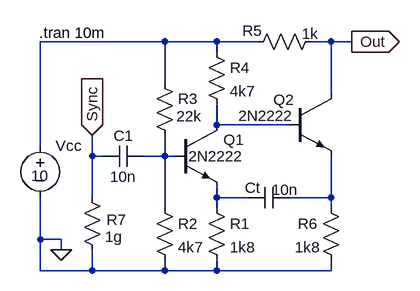
[diagram p0: schematic 2Q&1C_Multivib.asc]
2Q&1C_Multivib.asc, the LTspice schematic file:
Version 4
SHEET 1 880 680
WIRE 80 -16 -112 -16
WIRE 160 -16 80 -16
WIRE 224 -16 160 -16
WIRE 336 -16 304 -16
WIRE 368 -16 336 -16
WIRE 160 0 160 -16
WIRE 80 48 80 -16
WIRE 336 64 336 -16
WIRE 160 112 160 80
WIRE 272 112 160 112
WIRE -112 144 -112 -16
WIRE -32 160 -32 128
WIRE -16 160 -32 160
WIRE 80 160 80 128
WIRE 80 160 48 160
WIRE 96 160 80 160
WIRE -32 224 -32 160
WIRE 160 224 160 208
WIRE 208 224 160 224
WIRE 336 224 336 160
WIRE 336 224 272 224
WIRE 80 240 80 160
WIRE 160 240 160 224
WIRE 336 240 336 224
WIRE -112 288 -112 224
WIRE -80 288 -112 288
WIRE -80 304 -80 288
WIRE -112 336 -112 288
WIRE -32 336 -32 304
WIRE -32 336 -112 336
WIRE 80 336 80 320
WIRE 80 336 -32 336
WIRE 160 336 160 320
WIRE 160 336 80 336
WIRE 336 336 336 320
WIRE 336 336 160 336
FLAG -80 304 0
FLAG -32 128 Sync
IOPIN -32 128 In
FLAG 368 -16 Out
IOPIN 368 -16 Out
SYMBOL npn2 96 112 R0
WINDOW 0 74 23 Left 0
WINDOW 3 20 48 Left 0
SYMATTR InstName Q1
SYMATTR Value 2N2222
SYMBOL npn2 272 64 R0
WINDOW 0 -25 9 Left 0
WINDOW 3 -79 34 Left 0
SYMATTR InstName Q2
SYMATTR Value 2N2222
SYMBOL res 144 224 R0
SYMATTR InstName R1
SYMATTR Value 1k8
SYMBOL cap 272 208 R90
WINDOW 0 16 57 VBottom 0
WINDOW 3 -12 7 VTop 0
SYMATTR InstName Ct
SYMATTR Value 10n
SYMBOL res 64 224 R0
SYMATTR InstName R2
SYMATTR Value 4k7
SYMBOL res 64 32 R0
WINDOW 3 34 67 Left 0
SYMATTR InstName R3
SYMATTR Value 22k
SYMBOL res 144 -16 R0
SYMATTR InstName R4
SYMATTR Value 4k7
SYMBOL res 320 -32 R90
WINDOW 0 15 105 VBottom 0
WINDOW 3 -12 16 VTop 0
SYMATTR InstName R5
SYMATTR Value 1k
SYMBOL voltage -112 128 R0
WINDOW 3 -14 62 Left 0
SYMATTR InstName Vcc
SYMATTR Value 10
SYMBOL res 320 224 R0
WINDOW 0 -35 40 Left 0
WINDOW 3 -40 76 Left 0
SYMATTR InstName R6
SYMATTR Value 1k8
SYMBOL cap 48 144 R90
WINDOW 0 0 32 VBottom 0
WINDOW 3 32 32 VTop 0
SYMATTR InstName C1
SYMATTR Value 10n
SYMBOL res -48 208 R0
WINDOW 0 38 50 Left 0
SYMATTR InstName R7
SYMATTR Value 1g
TEXT -114 -30 Left 0 !.tran 10m

The netlist it stands for:
* 2Q&1C_Multivib.asc
Q1 N002 N003 N004 0 2N2222
Q2 Out N002 N005 0 2N2222
R1 N004 0 1k8
Ct N005 N004 10n
R2 N003 0 4k7
R3 N001 N003 22k
R4 N001 N002 4k7
R5 Out N001 1k
Vcc N001 0 10
R6 N005 0 1k8
C1 N003 Sync 10n
R7 Sync 0 1g
.model NPN NPN
.model PNP PNP
.lib standard.bjt
.tran 10m
.backanno
.end